# Altium schematic sheet RS485.SchDoc
size A; SheetNumber: 24; SheetTotal: 28
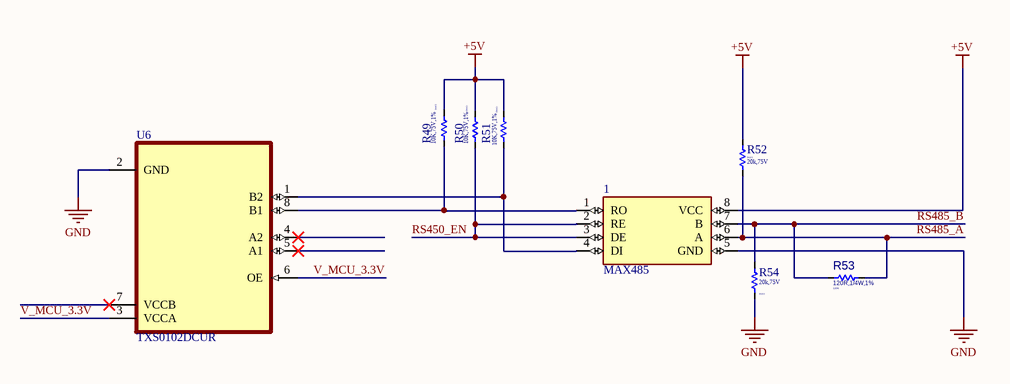
[diagram p0: RS485.SchDoc]

## Parts
1  MAX485  [MAX485]
R49  Package: 0603  [R0603]  (hidden comment: 10K,75V,1%)
R50  Package: 0603  [R0603]  (hidden comment: 10K,75V,1%)
R51  Package: 0603  [R0603]  (hidden comment: 10K,75V,1%)
R52  value 20k,75V  Package: 0603  [R0603]  (hidden comment: 20k)
R53  Package: 1206  [R1206]  (hidden comment: 120R,1/4W,1%)
R54  value 20k,75V  Package: 0603  [R0603]  (hidden comment: 20k)
U6  TXS0102DCUR  [8-VSSOP]

## Nets
+5V: 1.8(VCC) R49.2 R50.2 R51.2 R52.1
GND: 1.5(GND) R54.1 U6.2(GND)
RS450_EN: 1.2(RE) 1.3(DE) R50.1
RS485_A: 1.6(A) R52.2 R53.2
RS485_B: 1.7(B) R53.1 R54.2
V_MCU_3.3V: U6.3(VCCA) U6.6(OE)
Net1_1: 1.1(RO) R49.1 U6.8(B1)
Net1_4: 1.4(DI) R51.1 U6.1(B2)

Not connected (* = marked no-connect by the designer): U6 4(A2)* 5(A1)* 7(VCCB)*

## Library data of the parts
1 = MAX485: 1/1 Transceiver Half RS422, RS485 8-SOIC; Manufacturer: Maxim Integrated; Package Reference: SOIC-8 Maxim Integrated; Value: *; MPN: MAX485
R49-R51 = 0603WAF1002T5E: 100mW Thick Film Resistors ±100ppm/℃ ±1% 10kΩ 0603 Chip Resistor - Surface Mount ROHS; Manufacturer: UNI-ROYAL(Uniroyal Elec); Max Operating Temp: 155℃; Min Operating Temp: -55℃; MPN: 0603WAF1002T5E; Datasheet: https://datasheet.lcsc.com/szlcsc/Uniroyal-Elec-0603WAF1002T5E_C25804.pdf; LCSC: C25804; Value: 10K,75V,1%
R52 R54 = 0603WAF2002T5E: 100mW Thick Film Resistors ±100ppm/℃ ±1% 20kΩ 0603 Chip Resistor - Surface Mount ROHS; Manufacturer: UNI-ROYAL(Uniroyal Elec); MPN: 0603WAF1002T5E; Datasheet: https://datasheet.lcsc.com/szlcsc/Uniroyal-Elec-0603WAF1002T5E_C25804.pdf; LCSC: C4184
R53 = RES_Template_1206: RES SMD 120 OHM 1% 1/4W 1206; Manufacturer: YAGEO; MPN: AC1206FR-07120RL; Type: SM; Min Operating Temp: -55°C; Max Operating Temp: 155°C; Datasheet: https://www.yageo.com/upload/media/product/productsearch/datasheet/rchip/PYu-RC_Group_51_RoHS_L_12.pdf; LCSC: C229293; Value: 120R,1/4W,1%
U6 = TXS0102DCUR: 2-Bit Bidirectional Voltage-Level Shifter for Open-Drain and Push-Pull Application 8-VSSOP -40 to 85; Manufacturer: Texas Instruments; Value: 2 Channel 24Mbps; Package: VSSOP-8 Texas Instruments; MPN: TXS0102DCUR; Datasheet: https://www.ti.com/general/docs/suppproductinfo.tsp?distId=10&gotoUrl=https%3A%2F%2Fwww.ti.com%2Flit%2Fgpn%2Ftxs0102; LCSC: C53434